# Altium schematic sheet 复位.SchDoc
size A4
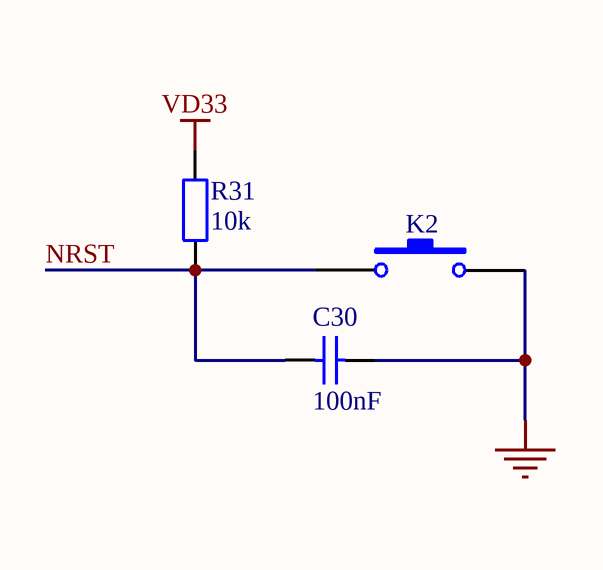
[diagram p0: 复位.SchDoc]

## Parts
C30  100nF  [LC-0805_C]
K2  �ᴥ����  [SW6X6]  (value not drawn)
R31  10k  [LC-0805_R]

## Nets
NetC30_2: C30.2 K2.2
VD33: R31.2
NRST: C30.1 K2.1 R31.1

## Library data of the parts
C30 = Cap: 100nF��0805��50V,+/-10%
K2 = SW-PB: �ᴥ����6��6mm,�Ľǲ��; Published: 24-Mar-1999; LatestRevisionDate: 17-Jul-2002; LatestRevisionNote: Re-released for DXP Platform.; PackageReference: SPST-2; Publisher: Altium Limited; PackageDescription: Switch; 2 Leads
R31 = R: 10k��,0805,��5%